# EAGLE design Brakelight_v3 (EAGLE 9.2.2)
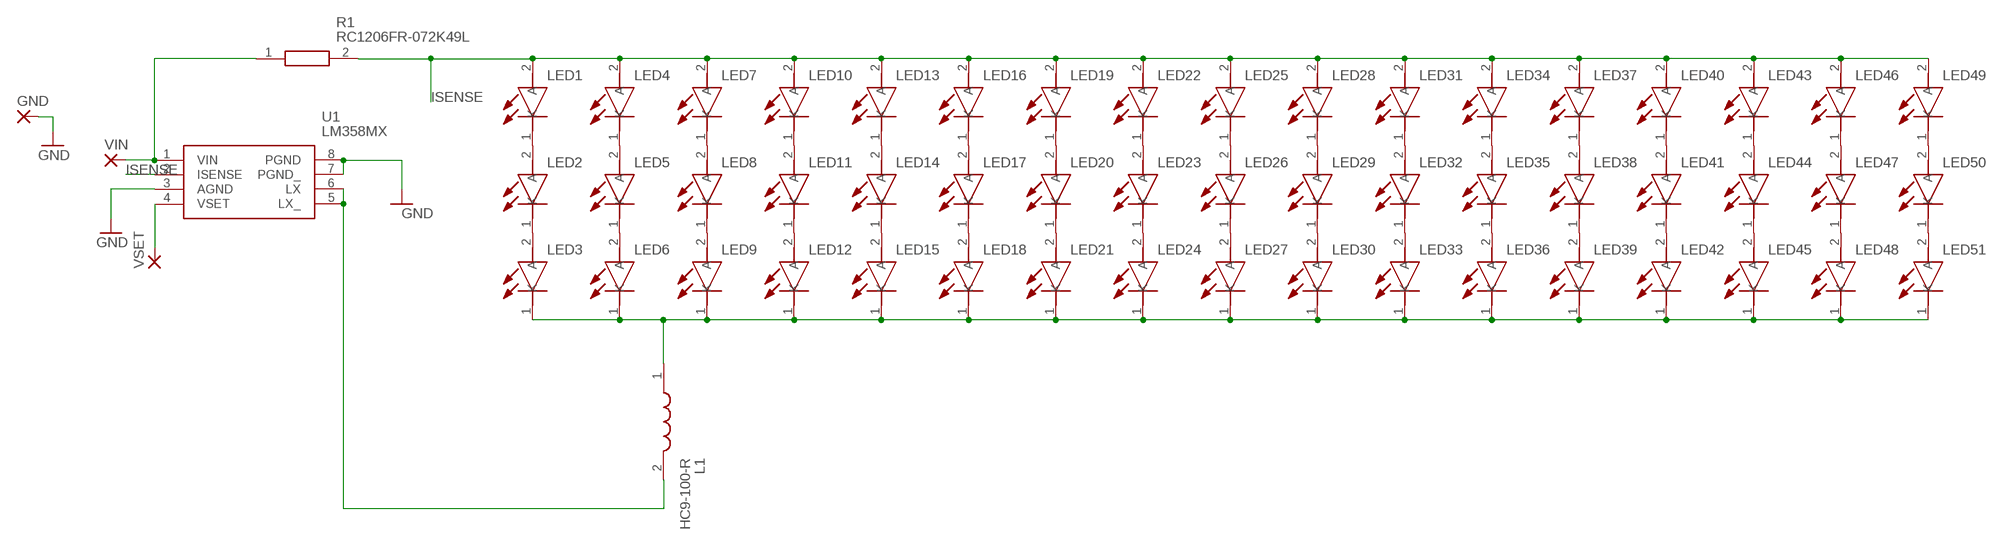
[diagram p0: schematic, sheet 1]

## Parts
GND  2,54/1,1  [2,54/1,1]
L1  HC9-100-R  [INDPM141131X770N]
LED1  SSL-LX5093TC  [SSL-LX5093SGC/B]
LED2  SSL-LX5093TC  [SSL-LX5093SGC/B]
LED3  SSL-LX5093TC  [SSL-LX5093SGC/B]
LED4  SSL-LX5093TC  [SSL-LX5093SGC/B]
LED5  SSL-LX5093TC  [SSL-LX5093SGC/B]
LED6  SSL-LX5093TC  [SSL-LX5093SGC/B]
LED7  SSL-LX5093TC  [SSL-LX5093SGC/B]
LED8  SSL-LX5093TC  [SSL-LX5093SGC/B]
LED9  SSL-LX5093TC  [SSL-LX5093SGC/B]
LED10  SSL-LX5093TC  [SSL-LX5093SGC/B]
LED11  SSL-LX5093TC  [SSL-LX5093SGC/B]
LED12  SSL-LX5093TC  [SSL-LX5093SGC/B]
LED13  SSL-LX5093TC  [SSL-LX5093SGC/B]
LED14  SSL-LX5093TC  [SSL-LX5093SGC/B]
LED15  SSL-LX5093TC  [SSL-LX5093SGC/B]
LED16  SSL-LX5093TC  [SSL-LX5093SGC/B]
LED17  SSL-LX5093TC  [SSL-LX5093SGC/B]
LED18  SSL-LX5093TC  [SSL-LX5093SGC/B]
LED19  SSL-LX5093TC  [SSL-LX5093SGC/B]
LED20  SSL-LX5093TC  [SSL-LX5093SGC/B]
LED21  SSL-LX5093TC  [SSL-LX5093SGC/B]
LED22  SSL-LX5093TC  [SSL-LX5093SGC/B]
LED23  SSL-LX5093TC  [SSL-LX5093SGC/B]
LED24  SSL-LX5093TC  [SSL-LX5093SGC/B]
LED25  SSL-LX5093TC  [SSL-LX5093SGC/B]
LED26  SSL-LX5093TC  [SSL-LX5093SGC/B]
LED27  SSL-LX5093TC  [SSL-LX5093SGC/B]
LED28  SSL-LX5093TC  [SSL-LX5093SGC/B]
LED29  SSL-LX5093TC  [SSL-LX5093SGC/B]
LED30  SSL-LX5093TC  [SSL-LX5093SGC/B]
LED31  SSL-LX5093TC  [SSL-LX5093SGC/B]
LED32  SSL-LX5093TC  [SSL-LX5093SGC/B]
LED33  SSL-LX5093TC  [SSL-LX5093SGC/B]
LED34  SSL-LX5093TC  [SSL-LX5093SGC/B]
LED35  SSL-LX5093TC  [SSL-LX5093SGC/B]
LED36  SSL-LX5093TC  [SSL-LX5093SGC/B]
LED37  SSL-LX5093TC  [SSL-LX5093SGC/B]
LED38  SSL-LX5093TC  [SSL-LX5093SGC/B]
LED39  SSL-LX5093TC  [SSL-LX5093SGC/B]
LED40  SSL-LX5093TC  [SSL-LX5093SGC/B]
LED41  SSL-LX5093TC  [SSL-LX5093SGC/B]
LED42  SSL-LX5093TC  [SSL-LX5093SGC/B]
LED43  SSL-LX5093TC  [SSL-LX5093SGC/B]
LED44  SSL-LX5093TC  [SSL-LX5093SGC/B]
LED45  SSL-LX5093TC  [SSL-LX5093SGC/B]
LED46  SSL-LX5093TC  [SSL-LX5093SGC/B]
LED47  SSL-LX5093TC  [SSL-LX5093SGC/B]
LED48  SSL-LX5093TC  [SSL-LX5093SGC/B]
LED49  SSL-LX5093TC  [SSL-LX5093SGC/B]
LED50  SSL-LX5093TC  [SSL-LX5093SGC/B]
LED51  SSL-LX5093TC  [SSL-LX5093SGC/B]
R1  RC1206FR-072K49L  [RESC3116X65N]
U1  LM358MX  [SOP127P600X180-8N]
VIN  2,54/1,1  [2,54/1,1]
VSET  2,54/1,1  [2,54/1,1]

## Nets
GND: GND.1(P) U1.3(AGND) U1.7(PGND_) U1.8(PGND)
ISENSE: LED1.2(A) LED4.2(A) LED7.2(A) LED10.2(A) LED13.2(A) LED16.2(A) LED19.2(A) LED22.2(A) LED25.2(A) LED28.2(A) LED31.2(A) LED34.2(A) LED37.2(A) LED40.2(A) LED43.2(A) LED46.2(A) LED49.2(A) R1.2 U1.2(ISENSE)
LEDK: L1.1 LED3.1(K) LED6.1(K) LED9.1(K) LED12.1(K) LED15.1(K) LED18.1(K) LED21.1(K) LED24.1(K) LED27.1(K) LED30.1(K) LED33.1(K) LED36.1(K) LED39.1(K) LED42.1(K) LED45.1(K) LED48.1(K) LED51.1(K)
N$1: LED1.1(K) LED2.2(A)
N$2: LED2.1(K) LED3.2(A)
N$3: LED4.1(K) LED5.2(A)
N$4: LED5.1(K) LED6.2(A)
N$5: LED7.1(K) LED8.2(A)
N$6: LED8.1(K) LED9.2(A)
N$7: LED10.1(K) LED11.2(A)
N$8: LED11.1(K) LED12.2(A)
N$9: LED13.1(K) LED14.2(A)
N$10: LED14.1(K) LED15.2(A)
N$11: LED16.1(K) LED17.2(A)
N$12: LED17.1(K) LED18.2(A)
N$13: LED19.1(K) LED20.2(A)
N$14: LED20.1(K) LED21.2(A)
N$15: LED22.1(K) LED23.2(A)
N$16: LED23.1(K) LED24.2(A)
N$17: LED25.1(K) LED26.2(A)
N$18: LED26.1(K) LED27.2(A)
N$19: LED28.1(K) LED29.2(A)
N$20: LED29.1(K) LED30.2(A)
N$21: LED31.1(K) LED32.2(A)
N$22: LED32.1(K) LED33.2(A)
N$23: LED34.1(K) LED35.2(A)
N$24: LED35.1(K) LED36.2(A)
N$25: LED37.1(K) LED38.2(A)
N$26: LED38.1(K) LED39.2(A)
N$27: LED40.1(K) LED41.2(A)
N$28: LED41.1(K) LED42.2(A)
N$29: LED43.1(K) LED44.2(A)
N$30: LED44.1(K) LED45.2(A)
N$31: LED46.1(K) LED47.2(A)
N$32: LED47.1(K) LED48.2(A)
N$33: LED49.1(K) LED50.2(A)
N$34: LED50.1(K) LED51.2(A)
N$35: U1.4(VSET) VSET.1(P)
N$37: L1.2 U1.5(LX_) U1.6(LX)
VIN: R1.1 U1.1(VIN) VIN.1(P)

## Library data of the parts
GND VIN VSET = wirepad:2,54/1,1: THROUGH-HOLE PAD
L1 = SMD Inductor 33 μH Type25:HC9-100-R: EATON COILTRONICS - HC9-100-R - INDUCTOR, HIGH CURRENT, 10UH, 8.5A Source: Datasheet <https://componentsearchengine.com/Datasheets/1/HC9-100-R.pdf>; DESCRIPTION: EATON COILTRONICS - HC9-100-R - INDUCTOR, HIGH CURRENT, 10UH, 8.5A; HEIGHT: 7.7mm; MANUFACTURER_NAME: Eaton; MANUFACTURER_PART_NUMBER: HC9-100-R; MOUSER_PART_NUMBER: 704-HC9-100-R
LED1-LED51 = 5mm (T-1 34) Round LED:SSL-LX5093TC: Lumex SSL-LX5093TC Turquoise LED, 5mm (T-1 3/4) Clear, Dome Lens Through Hole Package Source: Datasheet <https://componentsearchengine.com/Datasheets/1/SSL-LX5093TC.pdf>; DESCRIPTION: Lumex SSL-LX5093TC Turquoise LED, 5mm (T-1 3/4) Clear, Dome Lens Through Hole Package; HEIGHT: mm; MANUFACTURER_NAME: Lumex; MANUFACTURER_PART_NUMBER: SSL-LX5093TC; MOUSER_PART_NUMBER: 696-SSL-LX5093TC
R1 = 1206_Resistor:RC1206FR-072K49L: YAGEO RC1206 VALUE1 Source: Datasheet <https://componentsearchengine.com/Datasheets/1/RC1206FR-072K49L.pdf>; DESCRIPTION: YAGEO RC1206 VALUE1; HEIGHT: 0.65mm; MANUFACTURER_NAME: YAGEO (PHYCOMP); MANUFACTURER_PART_NUMBER: RC1206FR-072K49L; MOUSER_PART_NUMBER: 603-RC1206FR-072K49L
U1 = PAM2863ECR LED Driver:LM358MX: Dual Operational Amplifier Source: Datasheet <https://componentsearchengine.com/Datasheets/1/LM358MX.pdf>; DESCRIPTION: Dual Operational Amplifier; HEIGHT: mm; MANUFACTURER_NAME: Fairchild Semiconductor; MANUFACTURER_PART_NUMBER: LM358MX; MOUSER_PART_NUMBER: 512-LM358MX

## Board
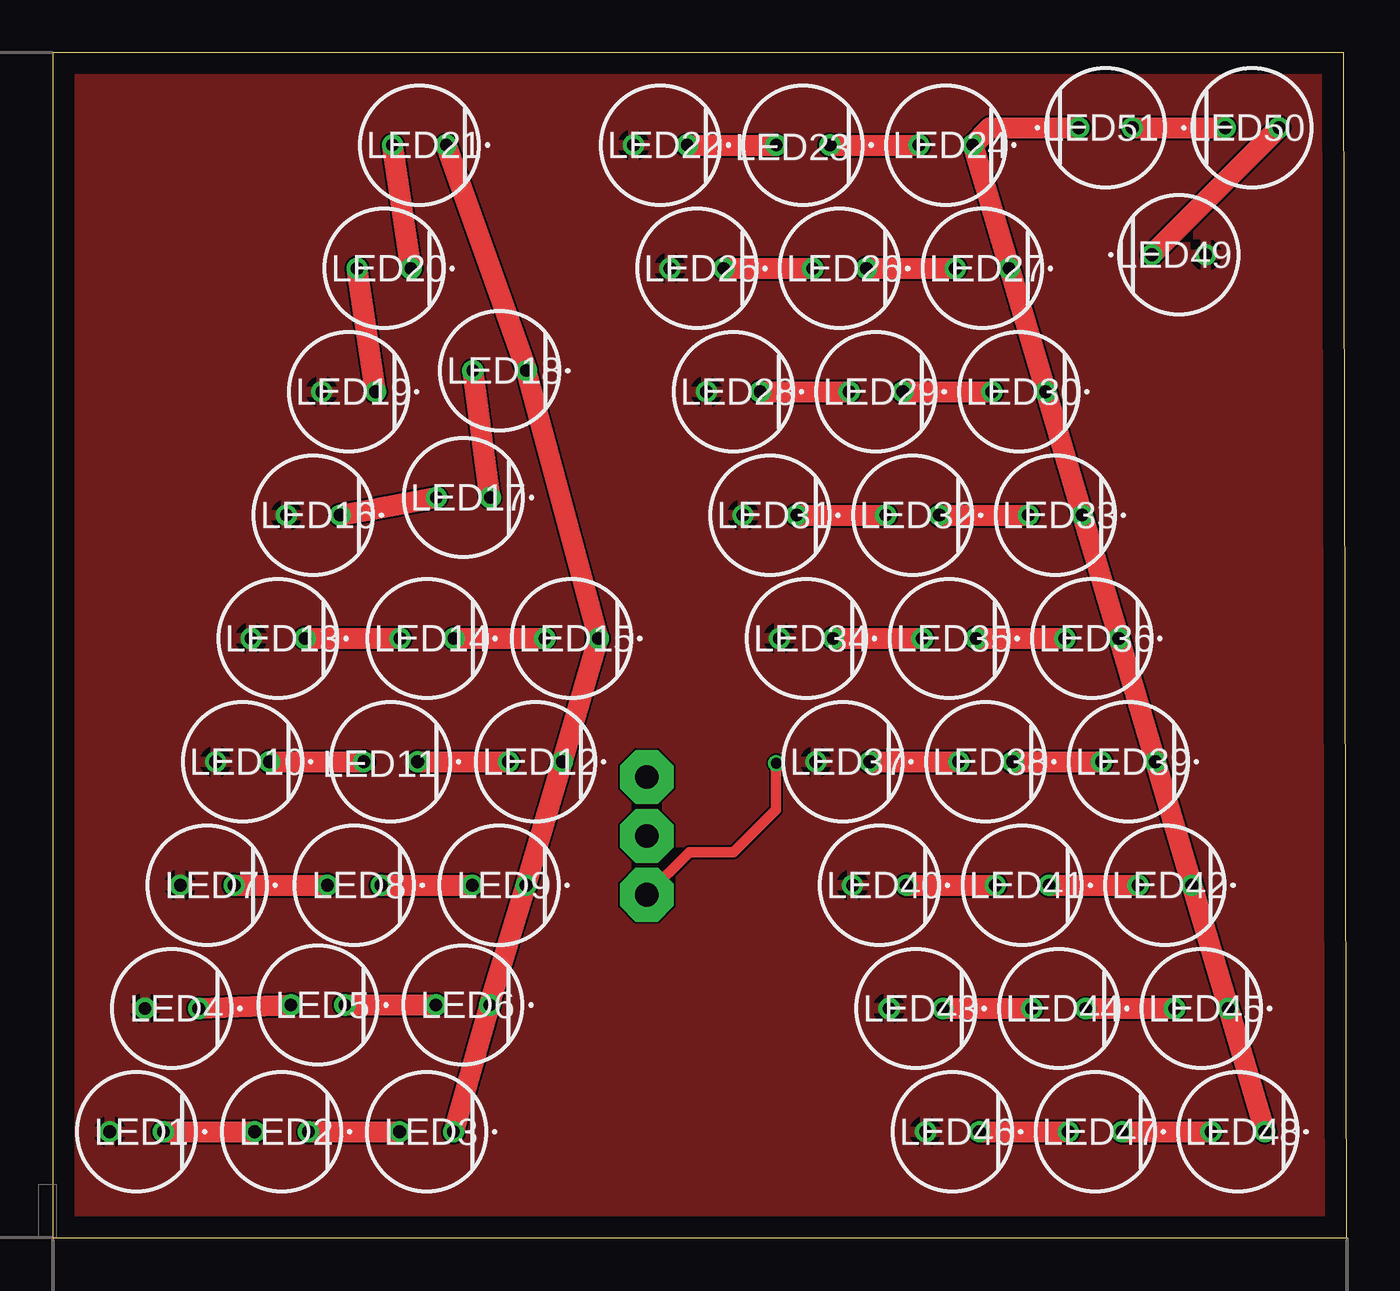
[diagram p1: board, top side]
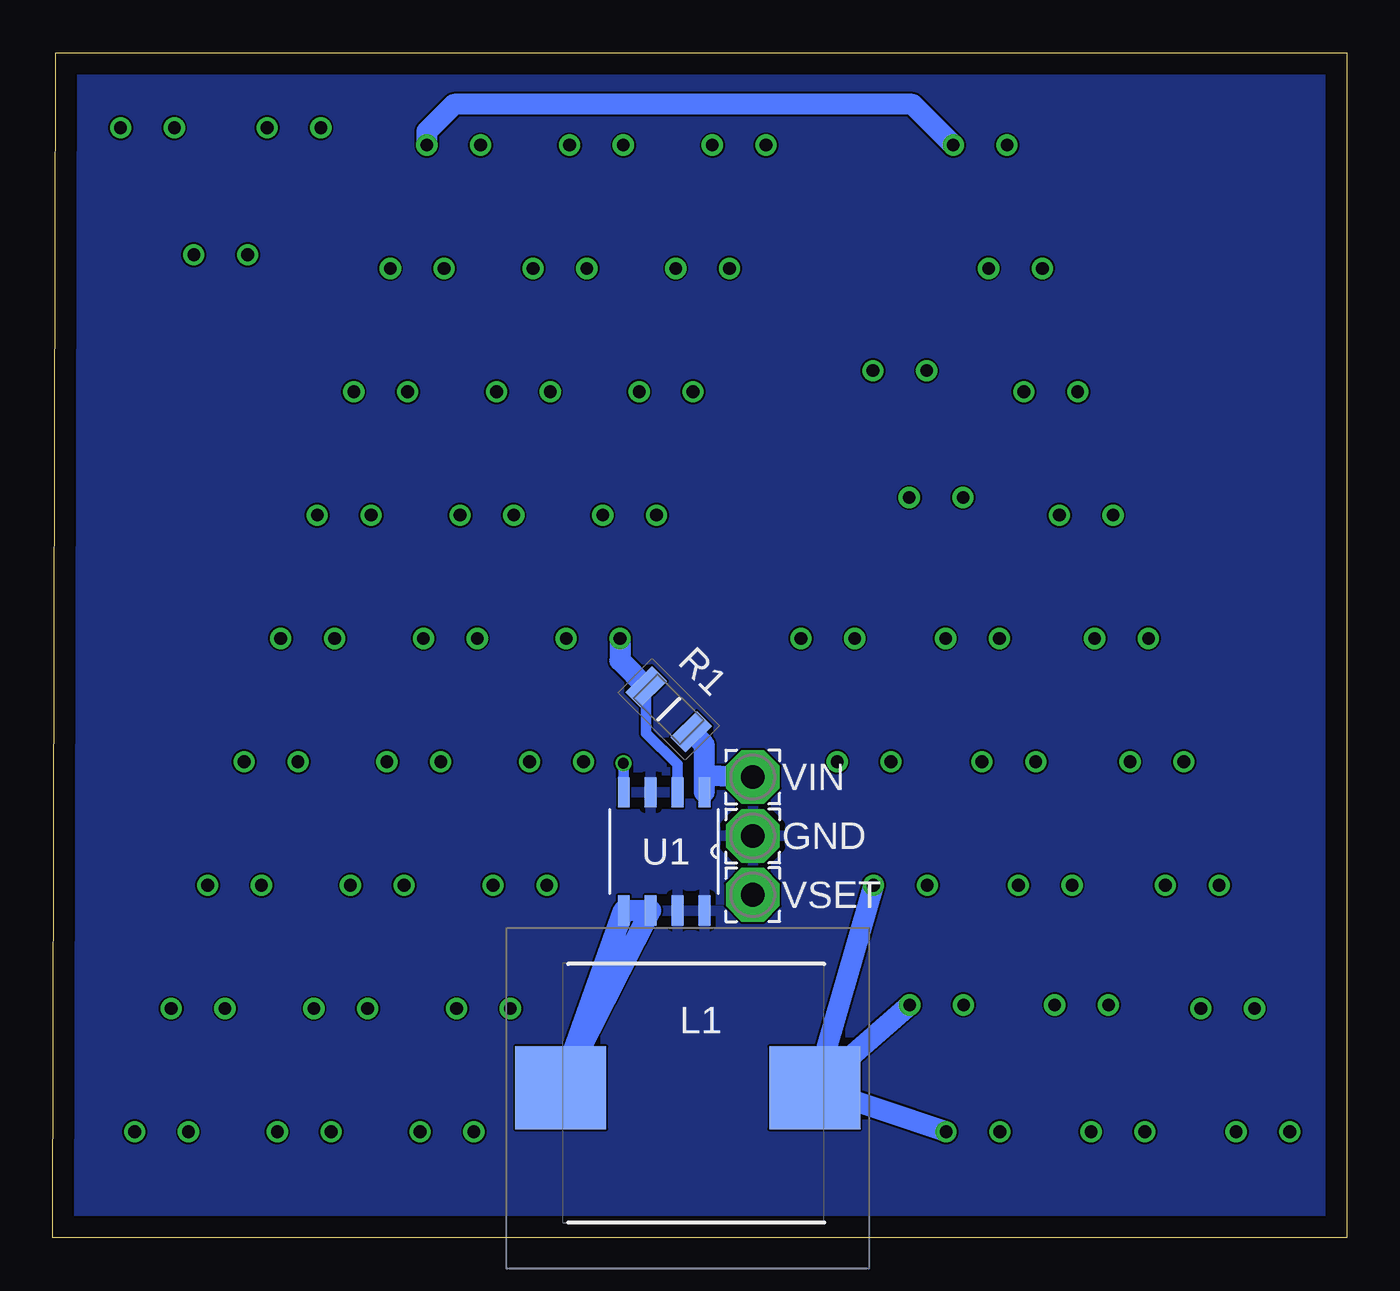
[diagram p2: board, bottom side, seen from below]

Size 61.09 x 55.93 mm. Coordinates in mm from the lower left corner, seen from the top.
Outline: 0,0 61.09,0 60.96,55.93 0,55.93 0,0
Copper layers (1*16): Top 0.035mm / dielectric 1.93mm / Bottom 0.035mm
Design rules "default *": minimum track width 3.5mil, minimum drill 0.2mm, track to track 3.5mil, track to pad 3.5mil, pad to pad 3.5mil, via to via 3.5mil, smd to smd 3.5mil, copper to edge 40mil, drill to drill 6mil, minimum pad ring 3mil, minimum via ring 3mil, stop-mask expansion 4mil, vias tented up to drill 0mil, thermal gap 10mil

### Footprints (pad centres in the part's own frame; a part is rotated, then mirrored left to right if it is on the bottom)
2,54/1,1 = drill 1.118 pad 2.54 octagon: 1 0,0
INDPM141131X770N = smd 4.3 x 3.9: 1 -5.5,0; 2 6.5,0
SSL-LX5093SGC/B = drill 0.6 pad 1: 1 1.27,0; 2 -1.27,0
RESC3116X65N = smd 1 x 1.75: 1 -1.5,0; 2 1.5,0
SOP127P600X180-8N = smd 1.422 x 0.559: 1 -2.794,1.905; 2 -2.794,0.635; 3 -2.794,-0.635; 4 -2.794,-1.905; 5 2.794,-1.905; 6 2.794,-0.635; 7 2.794,0.635; 8 2.794,1.905

### Placement (x,y rotation side)
GND  28.04,18.97 0 bottom
L1  30.61,7.08 180 bottom
LED1  3.95,5 0 top
LED2  10.8,5 0 top
LED3  17.64,5 0 top
LED4  5.62,10.82 0 top
LED5  12.51,10.99 0 top
LED6  19.36,10.99 0 top
LED7  7.29,16.65 0 top
LED8  14.23,16.65 0 top
LED9  21.07,16.65 0 top
LED10  8.96,22.47 0 top
LED11  15.95,22.47 0 top
LED12  22.78,22.47 0 top
LED13  10.62,28.29 0 top
LED14  17.67,28.29 0 top
LED15  24.5,28.29 0 top
LED16  12.29,34.11 0 top
LED17  19.38,34.95 0 top
LED18  21.1,40.93 0 top
LED19  13.96,39.94 0 top
LED20  15.63,45.76 0 top
LED21  17.3,51.58 0 top
LED22  28.68,51.58 0 top
LED23  35.42,51.58 0 top
LED24  42.16,51.58 0 top
LED25  30.41,45.76 0 top
LED26  37.15,45.76 0 top
LED27  43.89,45.76 0 top
LED28  32.13,39.94 0 top
LED29  38.87,39.94 0 top
LED30  45.61,39.94 0 top
LED31  33.86,34.11 0 top
LED32  40.6,34.11 0 top
LED33  47.34,34.11 0 top
LED34  35.58,28.29 0 top
LED35  42.32,28.29 0 top
LED36  49.06,28.29 0 top
LED37  37.31,22.47 0 top
LED38  44.05,22.47 0 top
LED39  50.79,22.47 0 top
LED40  39.03,16.65 0 top
LED41  45.77,16.65 0 top
LED42  52.51,16.65 0 top
LED43  40.76,10.82 0 top
LED44  47.5,10.82 0 top
LED45  54.24,10.82 0 top
LED46  42.48,5 0 top
LED47  49.22,5 0 top
LED48  55.96,5 0 top
LED49  53.17,46.41 180 top
LED50  56.63,52.41 180 top
LED51  49.71,52.41 180 top
R1  32.01,24.95 135 bottom
U1  32.23,18.24 270 bottom
VIN  28.04,21.75 0 bottom
VSET  28.04,16.19 0 bottom

### Tracks (layer width: path | path; a pad name or v marks a point on that pad's centre or on a via)
GND
  pour Bottom: 60.95,55.9 0.05,55.9 0.05,0 60.95,0
ISENSE
  Bottom 0.5: U1.2 31.59,22.34 33.07,23.82 R1.2
  Bottom 1: R1.2 34.31,27.25 LED34.2
  pour Top: 60.95,55.9 60.95,0 0.05,0 0.05,55.9
LEDK
  Top 1: LED48.1 LED45.1 LED42.1 LED39.1 LED36.1 LED33.1 LED30.1 LED27.1 LED24.1 44.25,52.41 LED51.1 | LED21.1 LED18.1 LED15.1 LED12.1 LED9.1 LED6.1 LED3.1
  Bottom 1: LED9.1 L1.1 | LED24.1 43.43,52.22 42.15,53.5 20.49,53.5 LED21.1 | LED6.1 L1.1 | LED3.1 L1.1
N$1
  Top 1: LED1.1 LED2.2
N$2
  Top 1: LED2.1 LED3.2
N$3
  Top 1: LED4.1 LED5.2
N$4
  Top 1: LED5.1 LED6.2
N$5
  Top 1: LED7.1 LED8.2
N$6
  Top 1: LED8.1 LED9.2
N$7
  Top 1: LED10.1 LED11.2
N$8
  Top 1: LED11.1 LED12.2
N$9
  Top 1: LED13.1 LED14.2
N$10
  Top 1: LED14.1 LED15.2
N$11
  Top 1: LED16.1 LED17.2
N$12
  Top 1: LED17.1 LED18.2
N$13
  Top 1: LED19.1 LED20.2
N$14
  Top 1: LED20.1 LED21.2
N$15
  Top 1: LED22.1 LED23.2
N$16
  Top 1: LED23.1 LED24.2
N$17
  Top 1: LED25.1 LED26.2
N$18
  Top 1: LED26.1 LED27.2
N$19
  Top 1: LED28.1 LED29.2
N$20
  Top 1: LED29.1 LED30.2
N$21
  Top 1: LED31.1 LED32.2
N$22
  Top 1: LED32.1 LED33.2
N$23
  Top 1: LED34.1 LED35.2
N$24
  Top 1: LED35.1 LED36.2
N$25
  Top 1: LED37.1 LED38.2
N$26
  Top 1: LED38.1 LED39.2
N$27
  Top 1: LED40.1 LED41.2
N$28
  Top 1: LED41.1 LED42.2
N$29
  Top 1: LED43.1 LED44.2
N$30
  Top 1: LED44.1 LED45.2
N$31
  Top 1: LED46.1 LED47.2
N$32
  Top 1: LED47.1 LED48.2
N$33
  Top 1: LED50.2 LED49.1
N$34
  Top 1: LED51.2 LED50.1
N$35  (via drill 0.5)
  Top 0.5: VSET.1 30.05,18.2 32.15,18.2 34.15,20.2 v34.15,22.4
  Bottom 0.5: v34.15,22.4 34.13,22.39 U1.4
N$37
  Bottom 1: L1.2 U1.5 U1.6 L1.2
VIN
  Bottom 1: U1.1 30.32,21.8 | 30.32,21.8 30.32,23.27 R1.1 | VIN.1 30.32,21.8